# Altium schematic sheet FPGA_PS.SchDoc
size A4; SheetNumber: 5; SheetTotal: 9
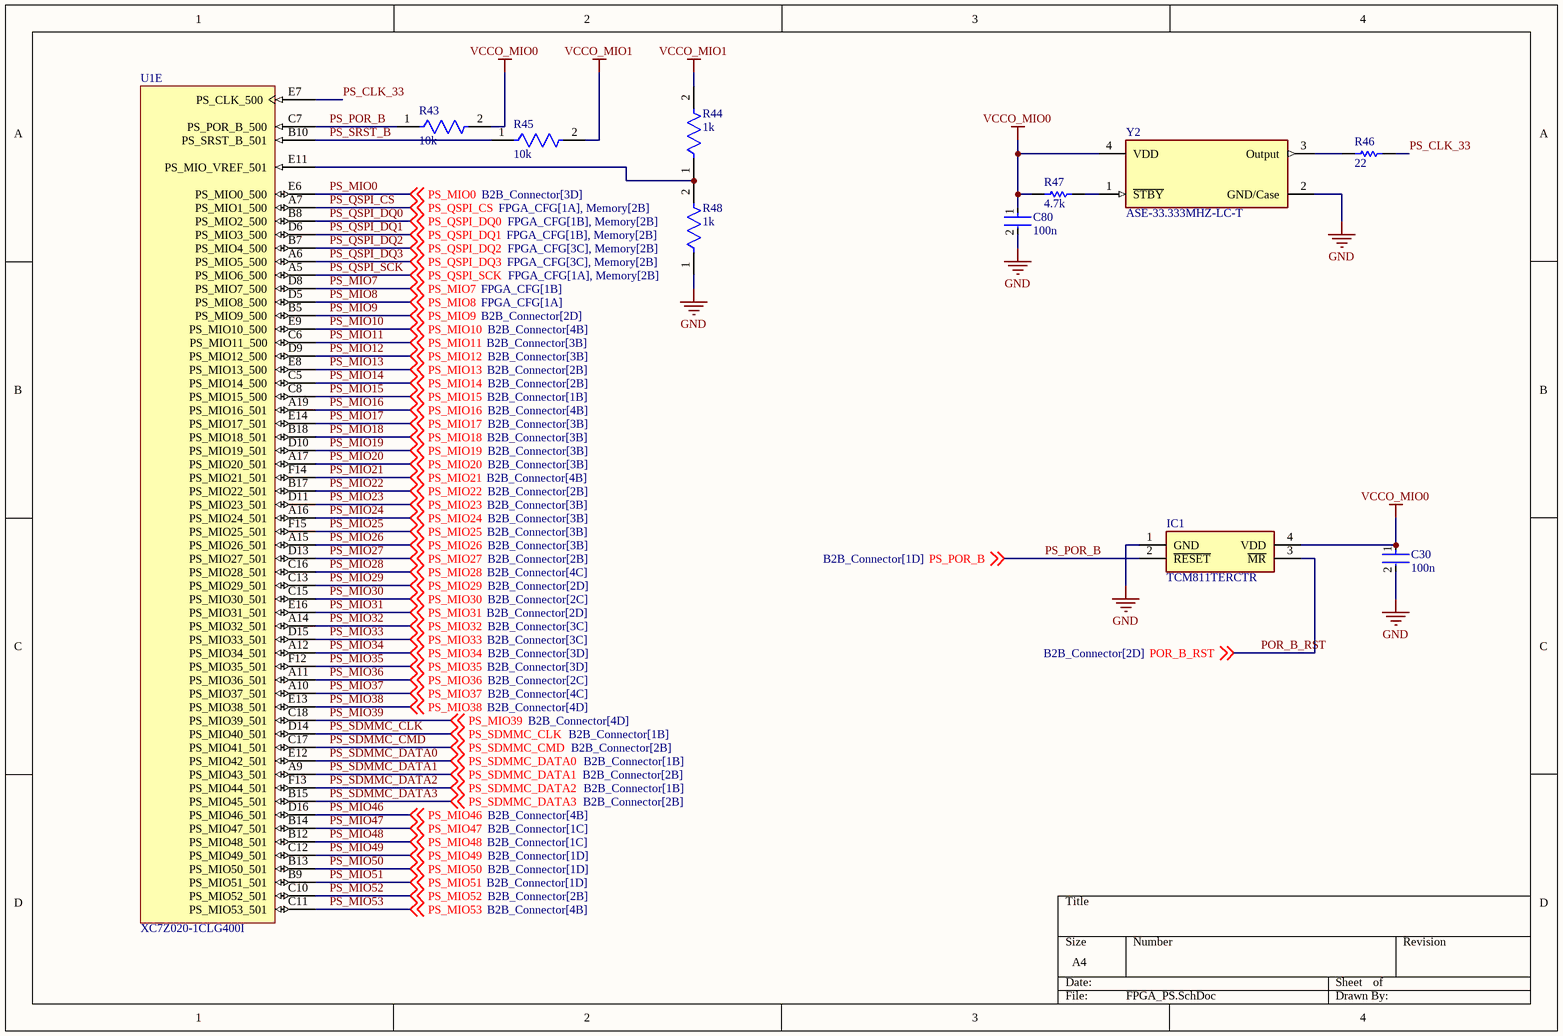
[diagram p0: FPGA_PS.SchDoc]

## Parts
C30  100n  [FP-CC0603-DA-MFG]
C80  100n  [FP-CC0603-DA-MFG]
IC1  TCM811TERCTR  [TCM811TERCTR]
R43  10k  [FP-RC0603-0_55-IPC_C]
R44  1k  [FP-RC0603-0_55-IPC_C]
R45  10k  [FP-RC0603-0_55-IPC_C]
R46  22  [RESC1608X55X25NL10T15]
R47  4.7k  [RESC1608X55X25LL10T15]
R48  1k  [FP-RC0603-0_55-IPC_C]
U1  XC7Z020-1CLG400I  [CLG400]  (part E of 9)
Y2  ASE-33.333MHZ-LC-T  [FP-ASE-MFG]

## Nets
GND: C30.2 C80.2 IC1.1(GND) R48.1 Y2.2(GND/Case)
VCCO_MIO0: C30.1 C80.1 IC1.4(VDD) R43.2 R47.1 Y2.4(VDD)
VCCO_MIO1: R44.2 R45.2
POR_B_RST: IC1.3(~{MR}) ; off-sheet POR_B_RST
PS_CLK_33: R46.2 U1.E7(PS_CLK_500)
PS_MIO0: U1.E6(PS_MIO0_500) ; off-sheet PS_MIO0
PS_MIO7: U1.D8(PS_MIO7_500) ; off-sheet PS_MIO7
PS_MIO8: U1.D5(PS_MIO8_500) ; off-sheet PS_MIO8
PS_MIO9: U1.B5(PS_MIO9_500) ; off-sheet PS_MIO9
PS_MIO10: U1.E9(PS_MIO10_500) ; off-sheet PS_MIO10
PS_MIO11: U1.C6(PS_MIO11_500) ; off-sheet PS_MIO11
PS_MIO12: U1.D9(PS_MIO12_500) ; off-sheet PS_MIO12
PS_MIO13: U1.E8(PS_MIO13_500) ; off-sheet PS_MIO13
PS_MIO14: U1.C5(PS_MIO14_500) ; off-sheet PS_MIO14
PS_MIO15: U1.C8(PS_MIO15_500) ; off-sheet PS_MIO15
PS_MIO16: U1.A19(PS_MIO16_501) ; off-sheet PS_MIO16
PS_MIO17: U1.E14(PS_MIO17_501) ; off-sheet PS_MIO17
PS_MIO18: U1.B18(PS_MIO18_501) ; off-sheet PS_MIO18
PS_MIO19: U1.D10(PS_MIO19_501) ; off-sheet PS_MIO19
PS_MIO20: U1.A17(PS_MIO20_501) ; off-sheet PS_MIO20
PS_MIO21: U1.F14(PS_MIO21_501) ; off-sheet PS_MIO21
PS_MIO22: U1.B17(PS_MIO22_501) ; off-sheet PS_MIO22
PS_MIO23: U1.D11(PS_MIO23_501) ; off-sheet PS_MIO23
PS_MIO24: U1.A16(PS_MIO24_501) ; off-sheet PS_MIO24
PS_MIO25: U1.F15(PS_MIO25_501) ; off-sheet PS_MIO25
PS_MIO26: U1.A15(PS_MIO26_501) ; off-sheet PS_MIO26
PS_MIO27: U1.D13(PS_MIO27_501) ; off-sheet PS_MIO27
PS_MIO28: U1.C16(PS_MIO28_501) ; off-sheet PS_MIO28
PS_MIO29: U1.C13(PS_MIO29_501) ; off-sheet PS_MIO29
PS_MIO30: U1.C15(PS_MIO30_501) ; off-sheet PS_MIO30
PS_MIO31: U1.E16(PS_MIO31_501) ; off-sheet PS_MIO31
PS_MIO32: U1.A14(PS_MIO32_501) ; off-sheet PS_MIO32
PS_MIO33: U1.D15(PS_MIO33_501) ; off-sheet PS_MIO33
PS_MIO34: U1.A12(PS_MIO34_501) ; off-sheet PS_MIO34
PS_MIO35: U1.F12(PS_MIO35_501) ; off-sheet PS_MIO35
PS_MIO36: U1.A11(PS_MIO36_501) ; off-sheet PS_MIO36
PS_MIO37: U1.A10(PS_MIO37_501) ; off-sheet PS_MIO37
PS_MIO38: U1.E13(PS_MIO38_501) ; off-sheet PS_MIO38
PS_MIO39: U1.C18(PS_MIO39_501) ; off-sheet PS_MIO39
PS_MIO46: U1.D16(PS_MIO46_501) ; off-sheet PS_MIO46
PS_MIO47: U1.B14(PS_MIO47_501) ; off-sheet PS_MIO47
PS_MIO48: U1.B12(PS_MIO48_501) ; off-sheet PS_MIO48
PS_MIO49: U1.C12(PS_MIO49_501) ; off-sheet PS_MIO49
PS_MIO50: U1.B13(PS_MIO50_501) ; off-sheet PS_MIO50
PS_MIO51: U1.B9(PS_MIO51_501) ; off-sheet PS_MIO51
PS_MIO52: U1.C10(PS_MIO52_501) ; off-sheet PS_MIO52
PS_MIO53: U1.C11(PS_MIO53_501) ; off-sheet PS_MIO53
PS_POR_B: IC1.2(~{RESET}) R43.1 U1.C7(PS_POR_B_500) ; off-sheet PS_POR_B
PS_QSPI_CS: U1.A7(PS_MIO1_500) ; off-sheet PS_QSPI_CS
PS_QSPI_DQ0: U1.B8(PS_MIO2_500) ; off-sheet PS_QSPI_DQ0
PS_QSPI_DQ1: U1.D6(PS_MIO3_500) ; off-sheet PS_QSPI_DQ1
PS_QSPI_DQ2: U1.B7(PS_MIO4_500) ; off-sheet PS_QSPI_DQ2
PS_QSPI_DQ3: U1.A6(PS_MIO5_500) ; off-sheet PS_QSPI_DQ3
PS_QSPI_SCK: U1.A5(PS_MIO6_500) ; off-sheet PS_QSPI_SCK
PS_SDMMC_CLK: U1.D14(PS_MIO40_501) ; off-sheet PS_SDMMC_CLK
PS_SDMMC_CMD: U1.C17(PS_MIO41_501) ; off-sheet PS_SDMMC_CMD
PS_SDMMC_DATA0: U1.E12(PS_MIO42_501) ; off-sheet PS_SDMMC_DATA0
PS_SDMMC_DATA1: U1.A9(PS_MIO43_501) ; off-sheet PS_SDMMC_DATA1
PS_SDMMC_DATA2: U1.F13(PS_MIO44_501) ; off-sheet PS_SDMMC_DATA2
PS_SDMMC_DATA3: U1.B15(PS_MIO45_501) ; off-sheet PS_SDMMC_DATA3
PS_SRST_B: R45.1 U1.B10(PS_SRST_B_501)
NetR44_1: R44.1 R48.2 U1.E11(PS_MIO_VREF_501)
NetR46_1: R46.1 Y2.3(Output)
NetR47_2: R47.2 Y2.1(~{STBY})

## Library data of the parts
C30 C80 = CMP-2100-03601-2: CAP CER 0.1UF 50V X7R 0603; Manufacturer: YAGEO; Manufacturer Part Number: CC0603KRX7R9BB104; Material: Ceramic; Capacitance: 100 nF; Temperature Coefficient: 15%; Tolerance: 0.1; Value: 100 nF; Height: 0.9mm; Voltage: 50 V; ComponentLink2Description: Datasheet; Device Class L2: Capacitors; Temperature Range High: +125°C; Category: Cap; Footprint Url: http://www.yageo.com/exep/pages/download/literatures/UPY-C_GEN_24.pdf; ComponentLink2URL: http://www.yageo.com/documents/recent/UPY-GPHC_X7R_6.3V-to-50V_18.pdf; Package: CC0603-DA; Temperature: -55°C to +125°C; Voltage Rating: 50 V; Temperature Characteristic: X7R; Device Class L1: Passive Components; Temperature Range Low: -55°C; RoHS: TRUE; Automotive: No; Device Class L3: Ceramic Capacitors; Octopart: https://octopart.com/cc0603krx7r9bb104-yageo-42244635; Mouser Description: Multilayer Ceramic Capacitor, CC Series, 0.1 - F, - 10%, X7R, 50 V, 0603 [1608 Metric]; Lead Free: Yes; Digikey Description: CAP CER 0.1UF 50V X7R 0603
IC1 = TCM811TERCTR: Integrated Circuit; Manufacturer_Name: Microchip; Datasheet Link: http://ww1.microchip.com/downloads/en/DeviceDoc/21615c.pdf; Height: 1mm; Manufacturer_Part_Number: TCM811TERCTR; Mouser Part Number: 579-TCM811TERCTR; Mouser Price/Stock: https://www.mouser.co.uk/ProductDetail/Microchip-Technology/TCM811TERCTR?qs=oKK8NaWdAJvcHpWoIxKfkw%3D%3D
R43 R45 = CMP-2100-03664-2: RES 10K OHM 1% 1/10W 0603; Voltage Rating: 75V; Voltage Rating (DC): 50V; Resistance: 10kR; Power Rating: 100mW; Temperature Coefficient: 100ppm/°C; Depth: 0.8mm; Termination: SMD/SMT; Resistor Type: Thick Film; Series: RC; Construction: Rectangular; Features: Moisture Resistant; Packaging: Tape and Reel; Min Operating Temperature: -55°C; Number of Terminations: 2; Lead Pitch: 0.3mm; RoHS Compliant: Yes; Case/Package: 0603; Resistance Tolerance: 1%; Military Standard: Not; Weight: 7.1E-05oz; Number of Pins: 2; Tolerance: 1%; Length: 1.6mm; Case Code (Imperial): 0603; Lead Free: Lead Free; Width: 0.8mm; Max Power Dissipation: 100mW; Height: 0.45mm; Max Operating Temperature: 155°C; Case Code (Metric): 1608; Size Code: 0603
R44 R48 = CMP-1659-00009-5: RES 1K OHM 1% 1/10W 0603; Resistance: 1kR; Voltage Rating: 50V; Power Rating: 100mW; Temperature Coefficient: 100ppm/°C; Military Standard: Not; REACH SVHC: No SVHC; Size Code: 0603; Features: Moisture Resistant; Number of Terminations: 2; Technology: THICK FILM; Series: RC; Case Code (Metric): 1608; Resistance Tolerance: 1%; Resistor Type: Thick Film; Termination: SMD/SMT; Contact Plating: Tin; Radiation Hardening: No; Min Operating Temperature: -55°C; Max Operating Temperature: 155°C; Packaging: Tape and Reel; Max Power Dissipation: 100mW; RoHS Compliant: Yes; Height: 0.45mm; Lead Free: Lead Free; Case/Package: 0603; Length: 1.6mm; Tolerance: 1%; Case Code (Imperial): 0603; Construction: Rectangular; Depth: 0.8mm
R46 = CMP-1659-00033-1: Chip Resistor, 22 Ohm, +/- 1%, 0.1 W, -55 to 155 degC, 0603 (1608 Metric), RoHS, Tape and Reel; Max Ouput Current: 8 A; Case\Package: SIP; Max Input Voltage: 1.4 V; ComponentLink2URL: http://www.yageo.com/documents/recent/PYu-RC_Group_51_RoHS_L_04.pdf; RoHSCompliant: true; Max Operating Temperature: 100 degC; PackageDescription: 2-Pin Surface Mount Device, Body 1.6 x 0.8 mm; ComponentLink1Description: Manufacturer URL; ComponentLink1URL: http://www.yageo.com/; Length: 18.5 mm; REACH SVHC: Unknown; Pins: 4; DatasheetVersion: Rev. 4, 02/2016; PackageReference: 0603; Output Current: 8 A; Min Operating Temperature: -25 degC; Height: 19.6 mm; Mount: Through Hole; Radiation Hardening: No; ComponentLink2Description: Datasheet; Package Quantity: 200; Packaging: Rail/Tube
R47 = CMP-2000-06942-1: Chip Resistor, 4.7 KOhm, +/- 1%, 0.1 W, -55 to 155 degC, 0603 (1608 Metric), RoHS, Tape and Reel; Manufacturer: Yageo; Power Rating: 100mW; Temperature Coefficient: 100PPM/C; Resistance: 4.7kOhms; Voltage Rating: 50V; Package Reference: 0603; Series: RC; Datasheet Version: Rev. 7, 05/2017; Packaging: Reel; Termination Style: SMD/SMT; Datasheet URL: http://www.yageo.com/documents/recent/PYu-RC_Group_51_RoHS_L_7.pdf; Manufacturer URL: http://www.yageo.com/; Package Description: 2-Pin Surface Mount Device, Body 1.6 x 0.8 mm; Case Code - mm: 1608; Case Code - in: 0603; Mounting Technology: SurfaceMount; Operating Temperature Range: -55Cto+155C; Tolerance: 1%; Product: ThickFilmResistorsGeneralPurpose
U1 = CMP-0363-00001-3: 667 MHz Zynq™-7000 AP SoC, 130 PS I/O, 125 FPGA I/O, 400-Ball BGA, Speed Grade 1, Industrial Grade, Pb-Free; LUTs: 53200; Flip Flops: 106400; Extensible Block RAM (# 36Kb Blocks): 560 KB (140); Speed Grade: -1; RoHS: Pb-Free; ComponentLink3Description: DC and AC Switching Characteristics; ComponentLink6Description: PCB and Layout Guide; ComponentLink1Description: Datasheet; ComponentLink4URL: http://www.xilinx.com/support/packagefiles/z7packages/xc7z020clg400pkg.txt; ComponentLink2Description: Package Specification; PackageReference: CLG400; ComponentLink4Description: Package File; Generic Part Number: XC7Z020; ComponentLink6URL: http://www.xilinx.com/support/documentation/user_guides/ug483_7Series_PCB.pdf; PackageVersion: Rev 1.1, 09/2012; PartNumber: XC7Z020-1CLG400I; PackageDescription: Wire-Bond Chip-Scale BGA, Body 17 x 17 mm, 0.8 mm Pitch; ComponentLink5Description: Packaging and Pinout; ComponentLink2URL: http://www.xilinx.com/support/documentation/user_guides/ug865-Zynq-7000-Pkg-Pinout.pdf; ComponentLink5URL: http://www.xilinx.com/support/documentation/user_guides/ug865-Zynq-7000-Pkg-Pinout.pdf; DatasheetVersion: v1.2; Code_JEDEC: MO-275-MMAA-1; Mounting Technology: Surface Mount; ComponentLink3URL: http://www.xilinx.com/support/documentation/data_sheets/ds187-XC7Z010-XC7Z020-Data-Sheet.pdf; ComponentLink1URL: http://www.xilinx.com/support/documentation/data_sheets/ds190-Zynq-7000-Overview.pdf
Y2 = CMP-27762-010648-1: XTAL Oscillator 33.333MHz ±50ppm CMOS 3.3V 4-SMD 3.2mm x 2.5mm; Max Supply Voltage: 3.465V; Load Capacitance: 15pF; Min Supply Voltage: 3.135V; Max Supply Current: 13mA; Package Quantity: 1000; Frequency: 33.333MHz; Radiation Hardening: No; Case/Package: SMD/SMT; REACH SVHC: No SVHC; Max Operating Temperature: 85°C; Operating Supply Voltage: 3.3V; Depth: 2.5mm; Height: 0.047inch; Mount: Surface Mount; Lead Free: Lead Free; Width: 0.098inch; Packaging: Tape and Reel; Operating Frequency: 33.333 MHz; Series: ASE; Termination: SMD/SMT; Min Operating Temperature: -40°C; Frequency Stability: 50ppm; Number of Pins: 4; Length: 3.2mm